# EAGLE design mael (EAGLE 9.5.2)
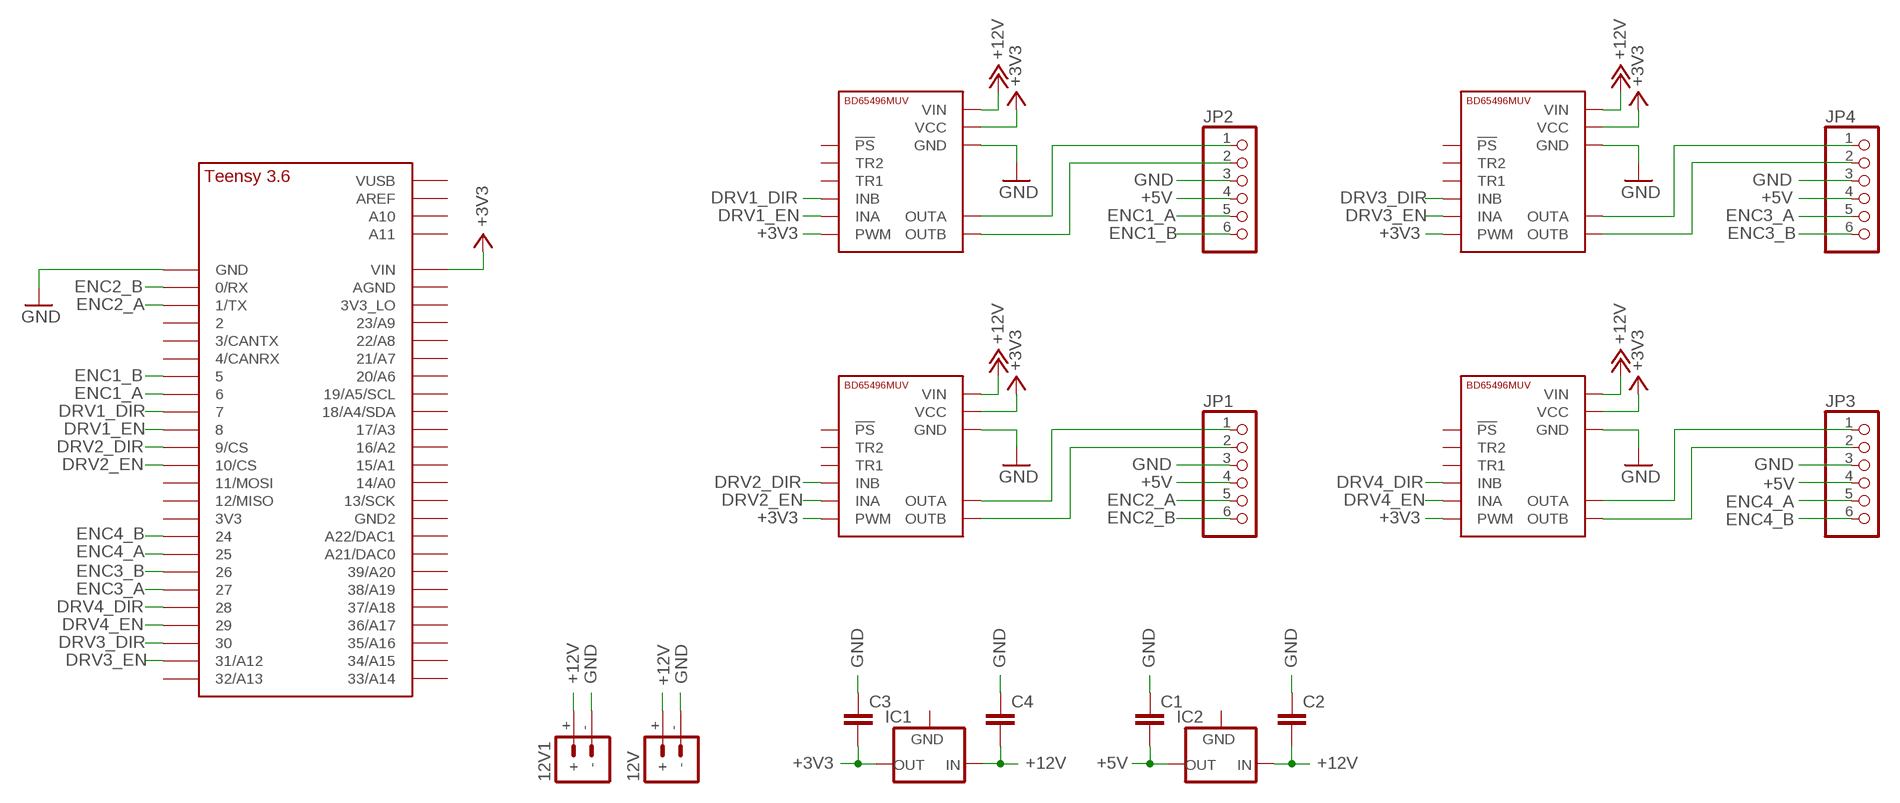
[diagram p0: schematic, sheet 1]

## Parts
12V  BATTERY_CONN_DEANS  [DEANS]
12V1  BATTERY_CONN_DEANS  [DEANS]
C1  C-EU050-024X044  [C050-024X044]
C2  C-EU050-024X044  [C050-024X044]
C3  C-EU050-024X044  [C050-024X044]
C4  C-EU050-024X044  [C050-024X044]
IC1  78XXL  [78XXL]
IC2  78XXL  [78XXL]
JP1  PINHD-1X6  [1X06]
JP2  PINHD-1X6  [1X06]
JP3  PINHD-1X6  [1X06]
JP4  PINHD-1X6  [1X06]
U$1  BD65496MUV  [BD65496MUV]
U$2  TEENSY_3.5/3.6_BASIC  [TEENSY_3.5/3.6_BASIC]
U$3  BD65496MUV  [BD65496MUV]
U$4  BD65496MUV  [BD65496MUV]
U$5  BD65496MUV  [BD65496MUV]

## Nets
+3V3: C3.2 IC1.OUT U$1.PWM U$1.VCC U$2.VIN U$3.PWM U$3.VCC U$4.PWM U$4.VCC U$5.PWM U$5.VCC
+5V: C1.2 IC2.OUT JP1.4 JP2.4 JP3.4 JP4.4
+12V: 12V1.+ 12V.+ C2.2 C4.2 IC1.IN IC2.IN U$1.VIN U$3.VIN U$4.VIN U$5.VIN
DRV1_DIR: U$1.INB U$2.7
DRV1_EN: U$1.INA U$2.8
DRV2_DIR: U$2.9/CS U$3.INB
DRV2_EN: U$2.10/CS U$3.INA
DRV3_DIR: U$2.30 U$4.INB
DRV3_EN: U$2.31/A12 U$4.INA
DRV4_DIR: U$2.28 U$5.INB
DRV4_EN: U$2.29 U$5.INA
ENC1_A: JP2.5 U$2.6
ENC1_B: JP2.6 U$2.5
ENC2_A: JP1.5 U$2.1/TX
ENC2_B: JP1.6 U$2.0/RX
ENC3_A: JP4.5 U$2.27
ENC3_B: JP4.6 U$2.26
ENC4_A: JP3.5 U$2.25
ENC4_B: JP3.6 U$2.24
GND: 12V1.- 12V.- C1.1 C2.1 C3.1 C4.1 JP1.3 JP2.3 JP3.3 JP4.3 U$1.GND1(GND) U$1.GND2(GND) U$2.GND U$3.GND1(GND) U$3.GND2(GND) U$4.GND1(GND) U$4.GND2(GND) U$5.GND1(GND) U$5.GND2(GND)
N$1: JP4.1 U$4.OUTA
N$2: JP4.2 U$4.OUTB
N$3: JP3.2 U$5.OUTB
N$4: JP3.1 U$5.OUTA
N$5: JP1.1 U$3.OUTA
N$6: JP1.2 U$3.OUTB
N$7: JP2.1 U$1.OUTA
N$8: JP2.2 U$1.OUTB
Unconnected: IC1.GND IC2.GND U$1.!PS U$1.TR1 U$1.TR2 U$2.2 U$2.3/CANTX U$2.3V3 U$2.3V3_LO U$2.4/CANRX U$2.11/MOSI U$2.12/MISO U$2.13/SCK U$2.14/A0 U$2.15/A1 U$2.16/A2 U$2.17/A3 U$2.18/A4/SDA U$2.19/A5/SCL U$2.20/A6 U$2.21/A7 U$2.21/DAC0(A21/DAC0) U$2.22/A8 U$2.23/A9 U$2.32/A13 U$2.33/A14 U$2.34/A15 U$2.35/A16 U$2.36/A17 U$2.37/A18 U$2.38/A19 U$2.39/A20 U$2.A10 U$2.A11 U$2.A22/DAC1 U$2.AGND U$2.AREF U$2.GND2 U$2.VUSB U$3.!PS U$3.TR1 U$3.TR2 U$4.!PS U$4.TR1 U$4.TR2 U$5.!PS U$5.TR1 U$5.TR2

## Library data of the parts
12V 12V1 = SparkFun-Connectors:BATTERY_CONN: Battery Connectors Various footprints for battery connections SparkFun Products: Deans Connector -M/F Pair <https://www.sparkfun.com/products/11864>; SF_ID: PRT-11864
C1-C4 = rcl:C-EU: CAPACITOR, European symbol; SPICEPREFIX: C
IC1 IC2 = v-reg:78XXL: VOLTAGE REGULATOR
JP1-JP4 = pinhead:PINHD-1X6: PIN HEADER
U$1 U$3-U$5 = parts:BD65496MUV
U$2 = teensy356:TEENSY_3.5/3.6_BASIC

## Board
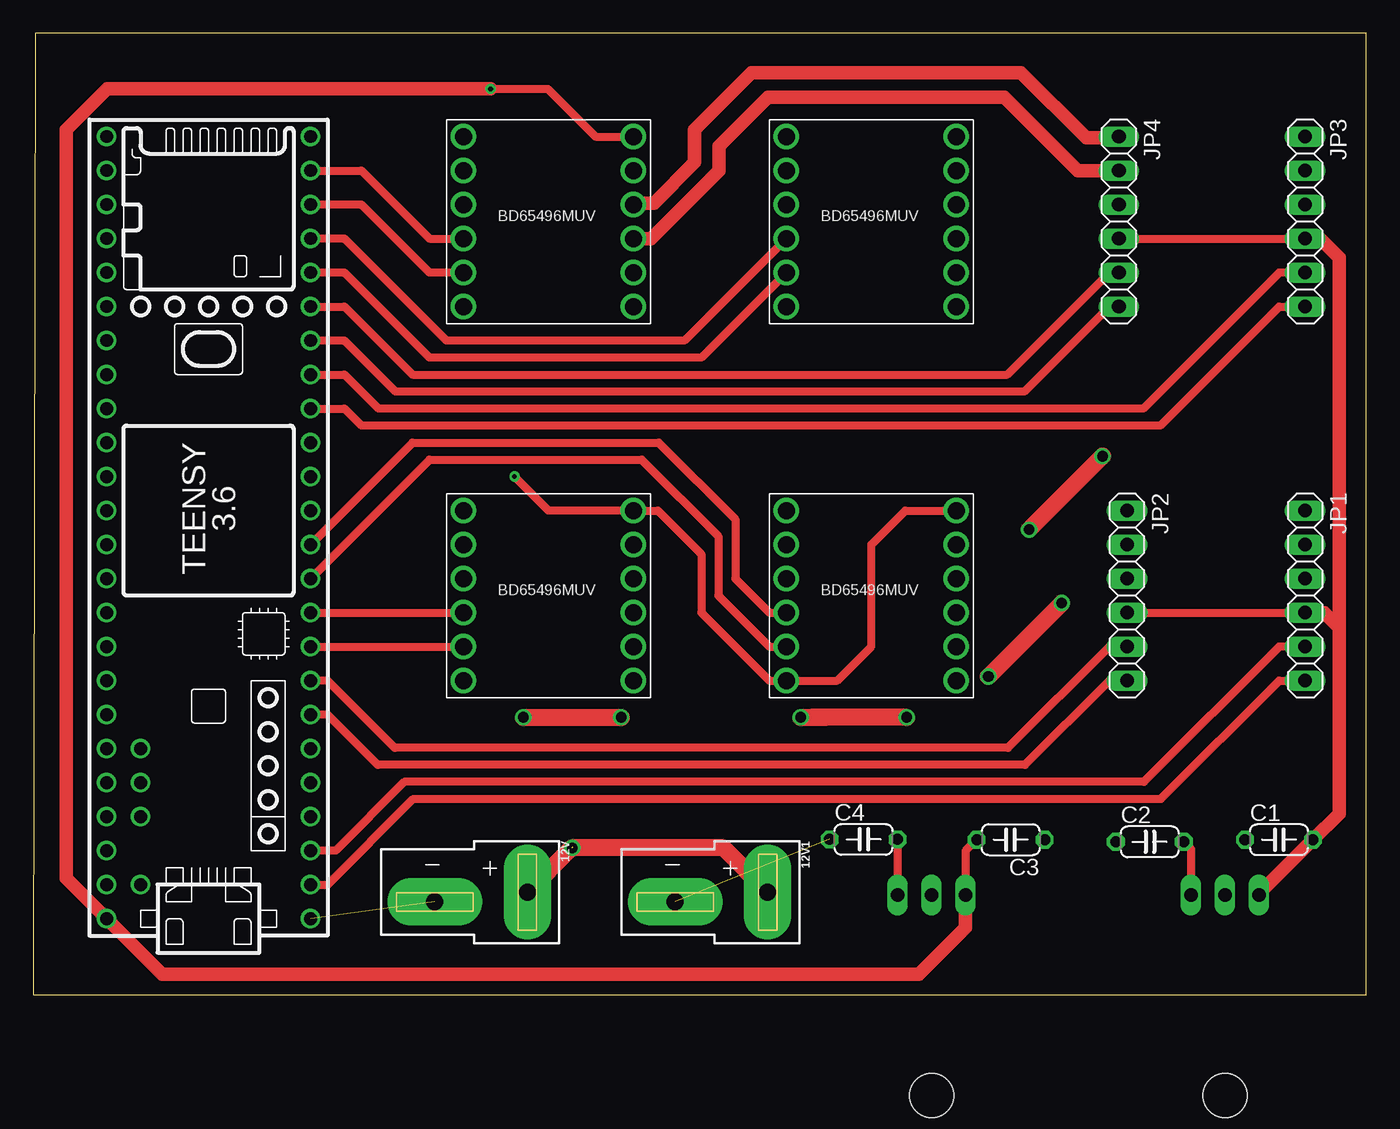
[diagram p1: board, top side]
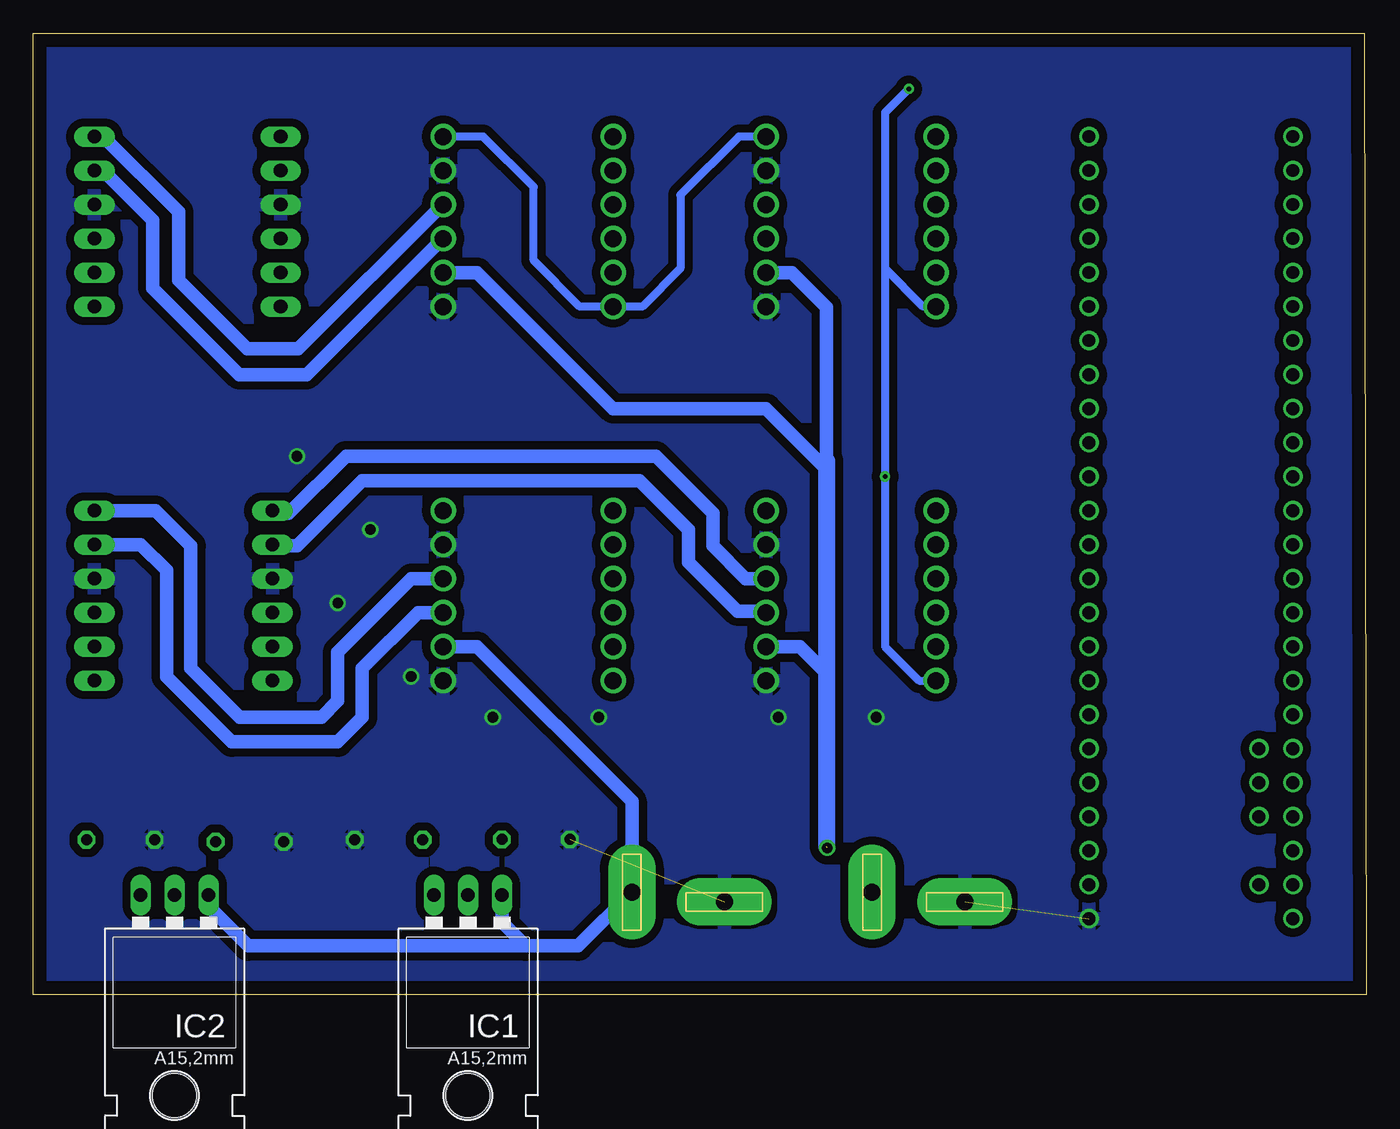
[diagram p2: board, bottom side, seen from below]

Size 99.57 x 71.81 mm. Coordinates in mm from the lower left corner, seen from the top.
Outline: 0,0 99.57,0 99.57,71.81 0.13,71.81 0,0
Copper layers (1*16): Top 0.035mm / dielectric 1.5mm / Bottom 0.035mm
Design rules "default": minimum track width 6mil, minimum drill 0.35mm, track to track 6mil, track to pad 6mil, pad to pad 6mil, via to via 6mil, smd to smd 6mil, copper to edge 40mil, drill to drill 6mil, minimum pad ring 10mil, minimum via ring 8mil, stop-mask expansion 4mil, vias tented up to drill 0mil, thermal gap 10mil

### Footprints (pad centres in the part's own frame; a part is rotated, then mirrored left to right if it is on the bottom)
DEANS = drill 1.27 pad 3.556 long: + 0,0; - 0.737,-6.921
C050-024X044 = drill 0.813 octagon: 1 -2.54,0; 2 2.54,0
78XXL = drill 1.016 long: GND 0,-3.81; IN -2.54,-3.81; OUT 2.54,-3.81 | hole 3.302: 0,11.176
1X06 = drill 1.016 long: 1 -6.35,0; 2 -3.81,0; 3 -1.27,0; 4 1.27,0; 5 3.81,0; 6 6.35,0
BD65496MUV = drill 1.27: !PS 1.27,13.97; GND1 13.97,11.43; GND2 13.97,1.27; INA 1.27,6.35; INB 1.27,3.81; OUTA 13.97,8.89; OUTB 13.97,6.35; PWM 1.27,1.27; TR1 1.27,11.43; TR2 1.27,8.89; VCC 13.97,13.97; VIN 13.97,3.81
TEENSY_3.5/3.6_BASIC = drill 0.965: 0/RX -25.4,-7.62; 1/TX -22.86,-7.62; 2 -20.32,-7.62; 3/CANTX -17.78,-7.62; 3V3 7.62,-7.62; 3V3_LO -22.86,7.62; 4/CANRX -15.24,-7.62; 5 -12.7,-7.62; 6 -10.16,-7.62; 7 -7.62,-7.62; 8 -5.08,-7.62; 9/CS -2.54,-7.62; 10/CS 0,-7.62; 11/MOSI 2.54,-7.62; 12/MISO 5.08,-7.62; 13/SCK 5.08,7.62; 14/A0 2.54,7.62; 15/A1 0,7.62; 16/A2 -2.54,7.62; 17/A3 -5.08,7.62; 18/A4/SDA -7.62,7.62; 19/A5/SCL -10.16,7.62; 20/A6 -12.7,7.62; 21/A7 -15.24,7.62; 21/DAC0 12.7,7.62; 22/A8 -17.78,7.62; 23/A9 -20.32,7.62; 24 10.16,-7.62; 25 12.7,-7.62; 26 15.24,-7.62; 27 17.78,-7.62; 28 20.32,-7.62; 29 22.86,-7.62; 30 25.4,-7.62; 31/A12 27.94,-7.62; 32/A13 30.48,-7.62; 33/A14 30.48,7.62; 34/A15 27.94,7.62; 35/A16 25.4,7.62; 36/A17 22.86,7.62; 37/A18 20.32,7.62; 38/A19 17.78,7.62; 39/A20 15.24,7.62; A10 -17.78,5.08; A11 -15.24,5.08; A22/DAC1 10.16,7.62; AGND -25.4,7.62; AREF -20.32,5.08; GND -27.94,-7.62; GND2 7.62,7.62; VIN -27.94,7.62; VUSB -25.4,5.08

### Placement (x,y rotation side)
12V  36.91,7.67 270 top
12V1  54.86,7.67 270 top
C1  93.07,11.58 0 top
C2  83.41,11.43 0 top
C3  73.03,11.58 180 top
C4  62.03,11.61 0 top
IC1  67.11,3.66 180 bottom
IC2  89.03,3.66 180 bottom
JP1  95.02,29.82 270 top
JP2  81.71,29.82 270 top
JP3  95.02,57.76 270 top
JP4  81.1,57.76 270 top
U$1  30.86,22.2 0 top
U$2  13.08,33.63 90 top
U$3  54.99,22.2 0 top
U$4  30.86,50.14 0 top
U$5  54.99,50.14 0 top

### Tracks (layer width: path | path; a pad name or v marks a point on that pad's centre or on a via)
+3V3  (via drill 0.35)
  Top 0.61: v35.94,38.71 38.48,36.17 U$1.VCC 46.66,36.17 49.91,32.92 49.91,28.55 54.99,23.47 U$3.PWM 60.07,23.47 62.61,26.01 62.61,33.63 65.15,36.17 U$3.VCC | v34.16,67.67 38.43,67.67 41.99,64.11 U$4.VCC | C3.2 69.65,10.74 IC1.OUT
  Top 1.016: IC1.OUT 69.65,5 66.17,1.52 9.63,1.52 U$2.VIN 2.46,8.69 2.46,64.62 5.51,67.67 v34.16,67.67
  Bottom 0.61: 35.94,54.25 35.94,65.89 v34.16,67.67 | 35.94,54.25 v35.94,38.71 35.94,26.01 33.4,23.47 U$1.PWM | U$4.VCC 46.86,64.11 51.23,59.74 51.23,54.25 54.08,51.41 U$5.PWM 58.75,51.41 62.2,54.86 62.2,60.35 65.96,64.11 U$5.VCC | U$4.PWM 33.1,51.41 35.94,54.25
+5V
  Top 0.61: JP4.4 JP3.4 | JP2.4 JP1.4 | 96.24,28.55 96.34,28.65
  Top 1.016: JP3.4 96.14,56.49 97.56,55.07 97.56,27.43 | 96.24,28.55 JP1.4 96.44,28.55 97.56,27.43 | 97.56,27.43 97.56,13.54 C1.2 91.57,7.54
  Top 1.27: 91.57,7.54 IC2.OUT
+12V  (via drill 0.8)  (1 unrouted)
  Top 0.61: C4.2 IC1.IN | C2.2 86.49,10.9 IC2.IN
  Top 1.27: 12V.+ 40.21,10.97 v40.26,10.97 51.56,10.97 12V1.+
  Bottom 1.016: U$1.VIN 42.29,26.01 40.31,24.03 | U$3.VIN 66.42,26.01 54.86,14.45 12V1.+ 58.88,3.66 62.81,3.66 | U$4.VIN 42.9,53.95 40.31,51.36 40.31,39.88 40.31,39.27 | 40.31,24.03 40.31,39.27 | 40.31,39.27 44.83,43.79 56.26,43.79 66.42,53.95 U$5.VIN | 40.31,24.03 40.31,23.77 | 62.81,3.66 83.54,3.66 86.49,6.6 IC2.IN | IC1.IN 64.57,5.41 62.81,3.66
  Bottom 1.27: 40.31,39.88 40.31,23.77 40.31,11.07 | 12V1.+ 54.86,8.56
DRV1_DIR
  Top 0.61: U$2.7 U$1.INB
DRV1_EN
  Top 0.61: U$2.8 U$1.INA
DRV2_DIR
  Top 0.61: U$2.9/CS 29.59,39.98 45.44,39.98 51.18,34.24 51.18,29.82 54.99,26.01 U$3.INB
DRV2_EN
  Top 0.61: U$2.10/CS 28.32,41.25 46.71,41.25 52.45,35.51 52.45,31.09 54.99,28.55 U$3.INA
DRV3_DIR
  Top 0.61: U$4.INB 29.59,53.95 24.51,59.03 U$2.30
DRV3_EN
  Top 0.61: U$4.INA 29.59,56.49 24.51,61.57 U$2.31/A12
DRV4_DIR
  Top 0.61: U$5.INB 49.91,47.6 29.59,47.6 23.24,53.95 U$2.28
DRV4_EN
  Top 0.61: U$5.INA 48.64,48.87 30.86,48.87 23.24,56.49 U$2.29
ENC1_A
  Top 0.61: JP2.5 80.39,26.01 72.82,18.44 27,18.44 21.97,23.47 U$2.6
ENC1_B
  Top 0.61: JP2.6 80.39,23.47 74.09,17.17 25.73,17.17 21.97,20.93 U$2.5
ENC2_A
  Top 0.61: JP1.5 93.09,26.01 82.98,15.9 27.71,15.9 22.58,10.77 U$2.1/TX
ENC2_B
  Top 0.61: U$2.0/RX 21.97,8.23 28.37,14.63 84.25,14.63 93.09,23.47 JP1.6
ENC3_A
  Top 0.61: JP4.5 80.39,53.95 72.77,46.33 28.32,46.33 23.24,51.41 U$2.27
ENC3_B
  Top 0.61: JP4.6 80.39,51.41 74.04,45.06 27.05,45.06 23.24,48.87 U$2.26
ENC4_A
  Top 0.61: JP3.5 93.09,53.95 82.93,43.79 25.78,43.79 23.24,46.33 U$2.25
ENC4_B
  Top 0.61: JP3.6 93.09,51.41 84.2,42.52 24.51,42.52 23.24,43.79 U$2.24
GND  (via drill 0.8)  (2 unrouted)
  Top 1.27: v65.25,20.73 58.11,20.73 | v57.33,20.73 59.16,20.73 | v36.6,20.73 v43.92,20.73 | v76.84,29.26 v71.35,23.77 | v74.4,34.75 v79.88,40.23
  pour Bottom (isolate 0.61): -1.19,71.93 -1.19,0 100.61,0 100.61,71.93
N$1
  Top 1.016: U$4.OUTA 44.93,59.13 46.36,59.13 49.4,62.18 49.4,64.62 53.67,68.89 73.79,68.89 78.66,64.01 81,64.01 JP4.1
N$2
  Top 1.016: JP4.2 78.05,61.57 72.57,67.06 54.89,67.06 51.23,63.4 51.23,61.57 46.15,56.49 U$4.OUTB
N$3
  Bottom 1.016: JP3.2 94.36,61.57 90.65,57.86 90.65,52.78 84.2,46.33 79.17,46.33 69.01,56.49 U$5.OUTB
N$4
  Bottom 1.016: U$5.OUTA 69.01,59.03 79.78,48.26 83.59,48.26 88.72,53.39 88.72,58.47 94.36,64.11 JP3.1
N$5
  Bottom 1.016: U$3.OUTA 71.35,31.09 76.84,25.6 76.84,21.95 78.05,20.73 84.15,20.73 87.81,24.38 87.81,33.53 90.45,36.17 JP1.1
N$6
  Bottom 1.016: U$3.OUTB 70.84,28.55 75.01,24.38 75.01,20.73 76.84,18.9 84.76,18.9 89.64,23.77 89.64,31.7 91.57,33.63 JP1.2
N$7
  Bottom 0.61: 81.66,36.17 JP2.1
  Bottom 1.016: U$1.OUTA 46.36,31.09 48.79,33.53 48.79,35.97 53.06,40.23 76.23,40.23 80.49,35.97 81.46,35.97 81.66,36.17
N$8
  Bottom 0.61: 81.66,33.63 JP2.2
  Bottom 1.016: U$1.OUTB 44.93,28.65 46.96,28.65 50.62,32.31 50.62,34.75 54.28,38.41 75.01,38.41 79.88,33.53 81.56,33.53 81.66,33.63